# Altium schematic sheet Adapter_Card_Connector.SchDoc
size A4; PageSetup: Record=PageOptions|CenterHorizontal=True|CenterVertical=True|PrintScale=0.92|XCorrection=1.00|YCorrection=1.00|PrintKind=0|BorderSize=5000000|LeftOffset=0|BottomOffset=0|Orientation=2|PaperLength=1000|PaperWidth=1000|Scale=100|PaperSource=7|PrintQuality=-4|MediaType=1|DitherType=10|PrintScaleMode=1|PaperKind=A4; CompanyName: Technische Hochschule Nürnberg Georg Simon Ohm; Organization: UltraZohm; Address1: Kesslerplatz 12; Address2: 90489 Nürnberg; Address3: GERMANY; DocumentNumber: 2; SheetNumber: 2; SheetTotal: 5; Website: www.ultrazohm.com
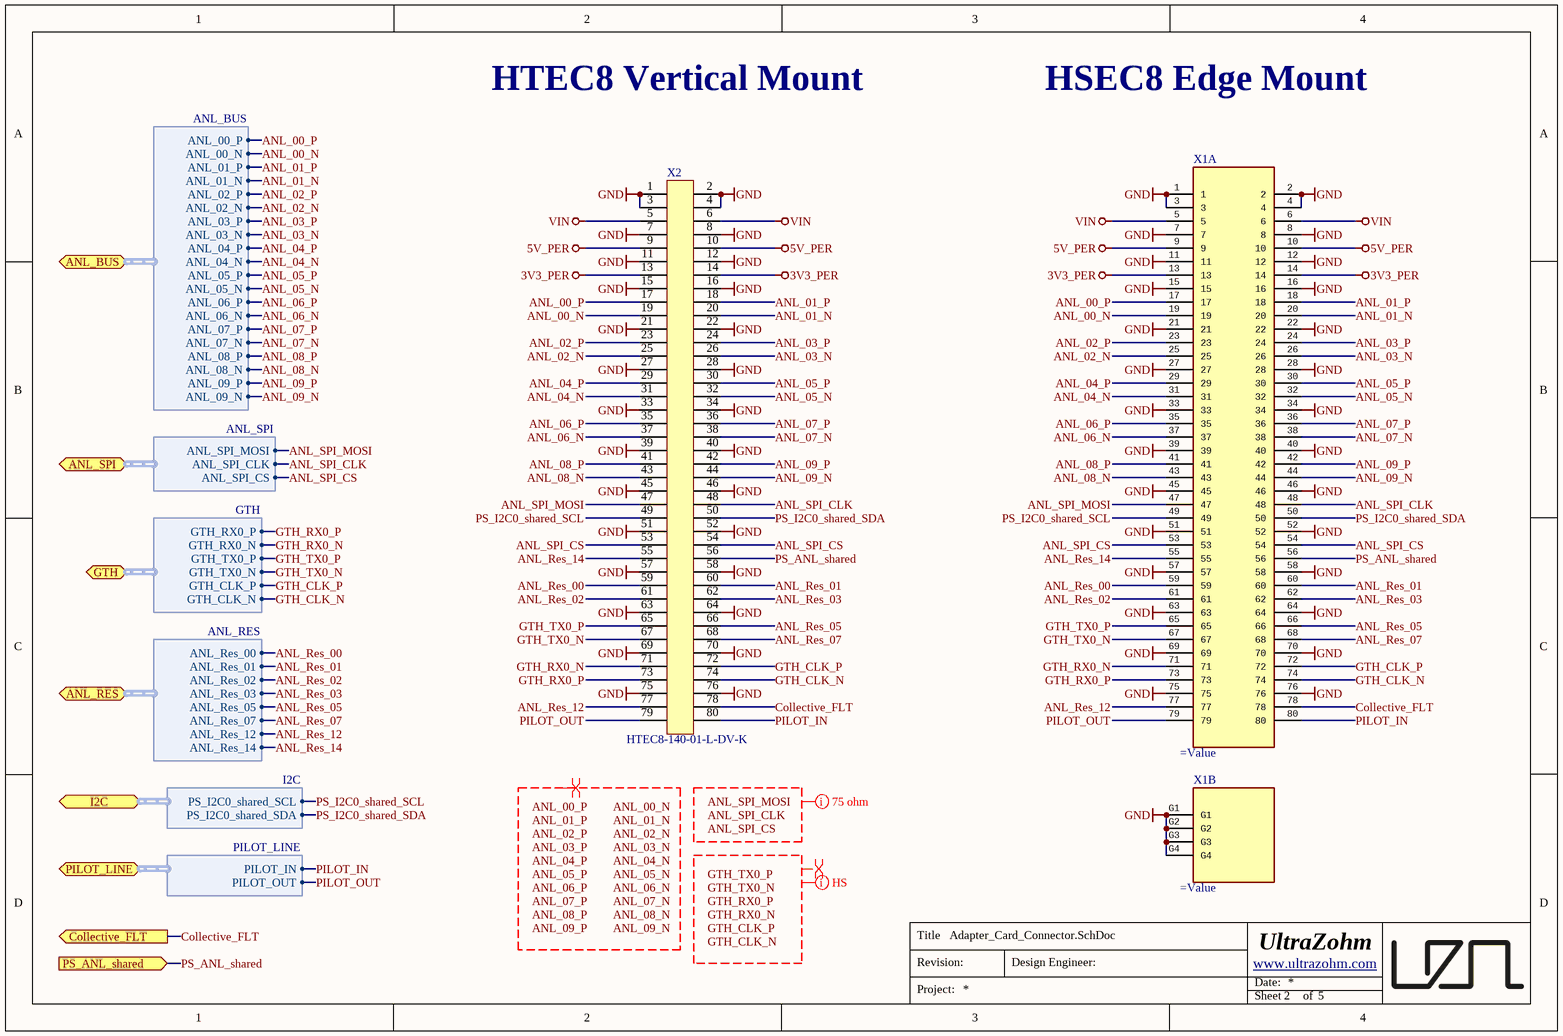
[diagram p0: Adapter_Card_Connector.SchDoc]

## Parts
X1  (no value)  [HSEC8-140-01-L-D-EM2]  (parts A,B of 2)
X2  HTEC8-140-01-L-DV-K  [HTEC8-140-XX-X-DV]

## Ports
ANL_BUS (bidir, harness ANL_BUS), ANL_RES (bidir, harness ANL_RES), ANL_SPI (bidir, harness ANL_SPI), Collective_FLT (out), GTH (bidir, harness GTH), I2C (bidir, harness I2C), PILOT_LINE (bidir, harness PILOT_LINE), PS_ANL_shared (in)

## Harnesses
I2C: PS_I2C0_shared_SDA, PS_I2C0_shared_SCL
PILOT_LINE: PILOT_OUT, PILOT_IN
ANL_BUS: ANL_00_P, ANL_00_N, ANL_01_P, ANL_01_N, ANL_02_P, ANL_02_N, ANL_03_P, ANL_03_N, ANL_04_P, ANL_04_N, ANL_05_P, ANL_05_N, ANL_06_P, ANL_06_N, ANL_07_P, ANL_07_N, ANL_08_P, ANL_08_N, ANL_09_P, ANL_09_N
ANL_RES: ANL_Res_00, ANL_Res_01, ANL_Res_02, ANL_Res_03, ANL_Res_05, ANL_Res_07, ANL_Res_12, ANL_Res_14
GTH: GTH_RX0_P, GTH_RX0_N, GTH_TX0_P, GTH_TX0_N, GTH_CLK_P, GTH_CLK_N
ANL_SPI: ANL_SPI_MOSI, ANL_SPI_CLK, ANL_SPI_CS

## Nets
3V3_PER: X1.13 X1.14 X2.13 X2.14
5V_PER: X1.9 X1.10 X2.9 X2.10
GND: X1.1 X1.2 X1.3 X1.4 X1.7 X1.8 X1.11 X1.12 X1.15 X1.16 X1.21 X1.22 X1.27 X1.28 X1.33 X1.34 X1.39 X1.40 X1.45 X1.46 X1.51 X1.52 X1.57 X1.58 X1.63 X1.64 X1.69 X1.70 X1.75 X1.76 X1.G1 X1.G2 X1.G3 X1.G4 X2.1 X2.2 X2.3 X2.4 X2.7 X2.8 X2.11 X2.12 X2.15 X2.16 X2.21 X2.22 X2.27 X2.28 X2.33 X2.34 X2.39 X2.40 X2.45 X2.46 X2.51 X2.52 X2.57 X2.58 X2.63 X2.64 X2.69 X2.70 X2.75 X2.76
VIN: X1.5 X1.6 X2.5 X2.6
ANL_00_N: X1.19 X2.19 ; port ANL_BUS.ANL_00_N
ANL_00_P: X1.17 X2.17 ; port ANL_BUS.ANL_00_P
ANL_01_N: X1.20 X2.20 ; port ANL_BUS.ANL_01_N
ANL_01_P: X1.18 X2.18 ; port ANL_BUS.ANL_01_P
ANL_02_N: X1.25 X2.25 ; port ANL_BUS.ANL_02_N
ANL_02_P: X1.23 X2.23 ; port ANL_BUS.ANL_02_P
ANL_03_N: X1.26 X2.26 ; port ANL_BUS.ANL_03_N
ANL_03_P: X1.24 X2.24 ; port ANL_BUS.ANL_03_P
ANL_04_N: X1.31 X2.31 ; port ANL_BUS.ANL_04_N
ANL_04_P: X1.29 X2.29 ; port ANL_BUS.ANL_04_P
ANL_05_N: X1.32 X2.32 ; port ANL_BUS.ANL_05_N
ANL_05_P: X1.30 X2.30 ; port ANL_BUS.ANL_05_P
ANL_06_N: X1.37 X2.37 ; port ANL_BUS.ANL_06_N
ANL_06_P: X1.35 X2.35 ; port ANL_BUS.ANL_06_P
ANL_07_N: X1.38 X2.38 ; port ANL_BUS.ANL_07_N
ANL_07_P: X1.36 X2.36 ; port ANL_BUS.ANL_07_P
ANL_08_N: X1.43 X2.43 ; port ANL_BUS.ANL_08_N
ANL_08_P: X1.41 X2.41 ; port ANL_BUS.ANL_08_P
ANL_09_N: X1.44 X2.44 ; port ANL_BUS.ANL_09_N
ANL_09_P: X1.42 X2.42 ; port ANL_BUS.ANL_09_P
ANL_Res_00: X1.59 X2.59 ; port ANL_RES.ANL_Res_00
ANL_Res_01: X1.60 X2.60 ; port ANL_RES.ANL_Res_01
ANL_Res_02: X1.61 X2.61 ; port ANL_RES.ANL_Res_02
ANL_Res_03: X1.62 X2.62 ; port ANL_RES.ANL_Res_03
ANL_Res_05: X1.66 X2.66 ; port ANL_RES.ANL_Res_05
ANL_Res_07: X1.68 X2.68 ; port ANL_RES.ANL_Res_07
ANL_Res_12: X1.77 X2.77 ; port ANL_RES.ANL_Res_12
ANL_Res_14: X1.55 X2.55 ; port ANL_RES.ANL_Res_14
ANL_SPI_CLK: X1.48 X2.48 ; port ANL_SPI.ANL_SPI_CLK
ANL_SPI_CS: X1.53 X1.54 X2.53 X2.54 ; port ANL_SPI.ANL_SPI_CS
ANL_SPI_MOSI: X1.47 X2.47 ; port ANL_SPI.ANL_SPI_MOSI
Collective_FLT: X1.78 X2.78 ; port Collective_FLT
GTH_CLK_N: X1.74 X2.74 ; port GTH.GTH_CLK_N
GTH_CLK_P: X1.72 X2.72 ; port GTH.GTH_CLK_P
GTH_RX0_N: X1.71 X2.71 ; port GTH.GTH_RX0_N
GTH_RX0_P: X1.73 X2.73 ; port GTH.GTH_RX0_P
GTH_TX0_N: X1.67 X2.67 ; port GTH.GTH_TX0_N
GTH_TX0_P: X1.65 X2.65 ; port GTH.GTH_TX0_P
PILOT_IN: X1.80 X2.80 ; port PILOT_LINE.PILOT_IN
PILOT_OUT: X1.79 X2.79 ; port PILOT_LINE.PILOT_OUT
PS_ANL_shared: X1.56 X2.56 ; port PS_ANL_shared
PS_I2C0_shared_SCL: X1.49 X2.49 ; port I2C.PS_I2C0_shared_SCL
PS_I2C0_shared_SDA: X1.50 X2.50 ; port I2C.PS_I2C0_shared_SDA

## Layout directives
net class S75: ANL_SPI_CLK, ANL_SPI_CS, ANL_SPI_MOSI
differential pair: ANL_00_N, ANL_00_P, ANL_01_N, ANL_01_P, ANL_02_N, ANL_02_P, ANL_03_N, ANL_03_P, ANL_04_N, ANL_04_P, ANL_05_N, ANL_05_P, ANL_06_N, ANL_06_P, ANL_07_N, ANL_07_P, ANL_08_N, ANL_08_P, ANL_09_N, ANL_09_P, GTH_CLK_N, GTH_CLK_P, GTH_RX0_N, GTH_RX0_P, GTH_TX0_N, GTH_TX0_P
net class HS: GTH_CLK_N, GTH_CLK_P, GTH_RX0_N, GTH_RX0_P, GTH_TX0_N, GTH_TX0_P

## Notes on the sheet
- HTEC8 Vertical Mount
- HSEC8 Edge Mount
- Labels drawn without touching a wire or pin: ANL_00_N, ANL_00_P, ANL_01_N, ANL_01_P, ANL_02_N, ANL_02_P, ANL_03_N, ANL_03_P, ANL_04_N, ANL_04_P, ANL_05_N, ANL_05_P, ANL_06_N, ANL_06_P, ANL_07_N, ANL_07_P, ANL_08_N, ANL_08_P, ANL_09_N, ANL_09_P, ANL_SPI_CLK, ANL_SPI_CS, ANL_SPI_MOSI, GTH_CLK_N, GTH_CLK_P, GTH_RX0_N, GTH_RX0_P, GTH_TX0_N, GTH_TX0_P
- Title
- Revision:
- Design Engineer:
- Date:
- Project:
- Sheet
- of

## Library data of the parts
X1 = HSEC8-140-01-L-D-EM2J: 80 Position Female Connector Non Specified - Dual Edge Gold 0.031" (0.80mm) Black; MF: SAMTEC; MPN: HSEC8-140-01-L-D-EM2; Created: 2021_04_07_AGeiger; Value: HSEC8-140-01-L-D-EM2
X2 = 30758: AN: 30758; Mixed: SMT; Temperature-Range: -55/+125; Extra: Samtec 0.80 mm High-Speed Edge Card Connector, 80pin 10µ Plating; Case: HTEC8; HelpURL: b:\AD\adlib\datasheet\Samtec\HTEC8\; H-ART: HTEC8-140-01-L-DV-K